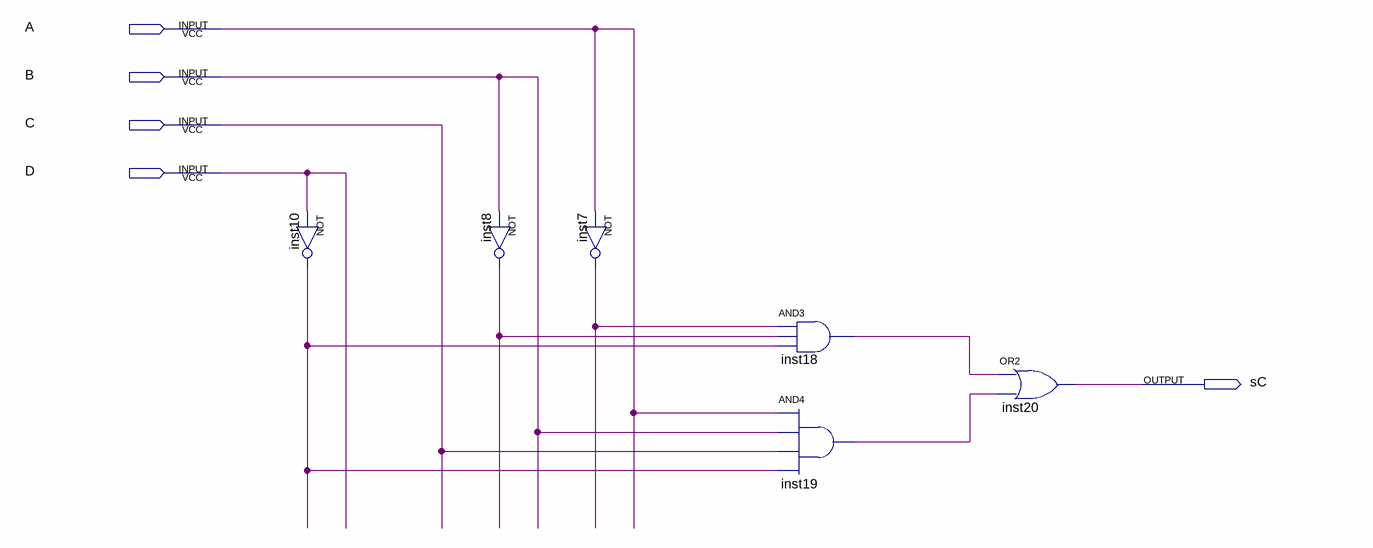
[diagram p0: schematic sheet]
// Quartus schematic decodificadorParcelaSaidaC.bdf as structural Verilog: 6 symbols, 5 pins
module decodificadorParcelaSaidaC (
  input  A,
  input  B,
  input  C,
  input  D,
  output sC
);

  wire inst7_out, inst8_out, inst10_out, inst18_out, inst19_out;

  not inst10 (inst10_out, D);
  not inst8 (inst8_out, B);
  not inst7 (inst7_out, A);
  and inst18 (inst18_out, inst7_out, inst8_out, inst10_out);
  and inst19 (inst19_out, A, B, C, inst10_out);
  or inst20 (sC, inst18_out, inst19_out);
endmodule
